# Altium schematic sheet SD Card.SchDoc: SD Card & SPI Select Switch
size 292 x 193 mm; DocumentNumber: 24; SheetNumber: 28; SheetTotal: 28
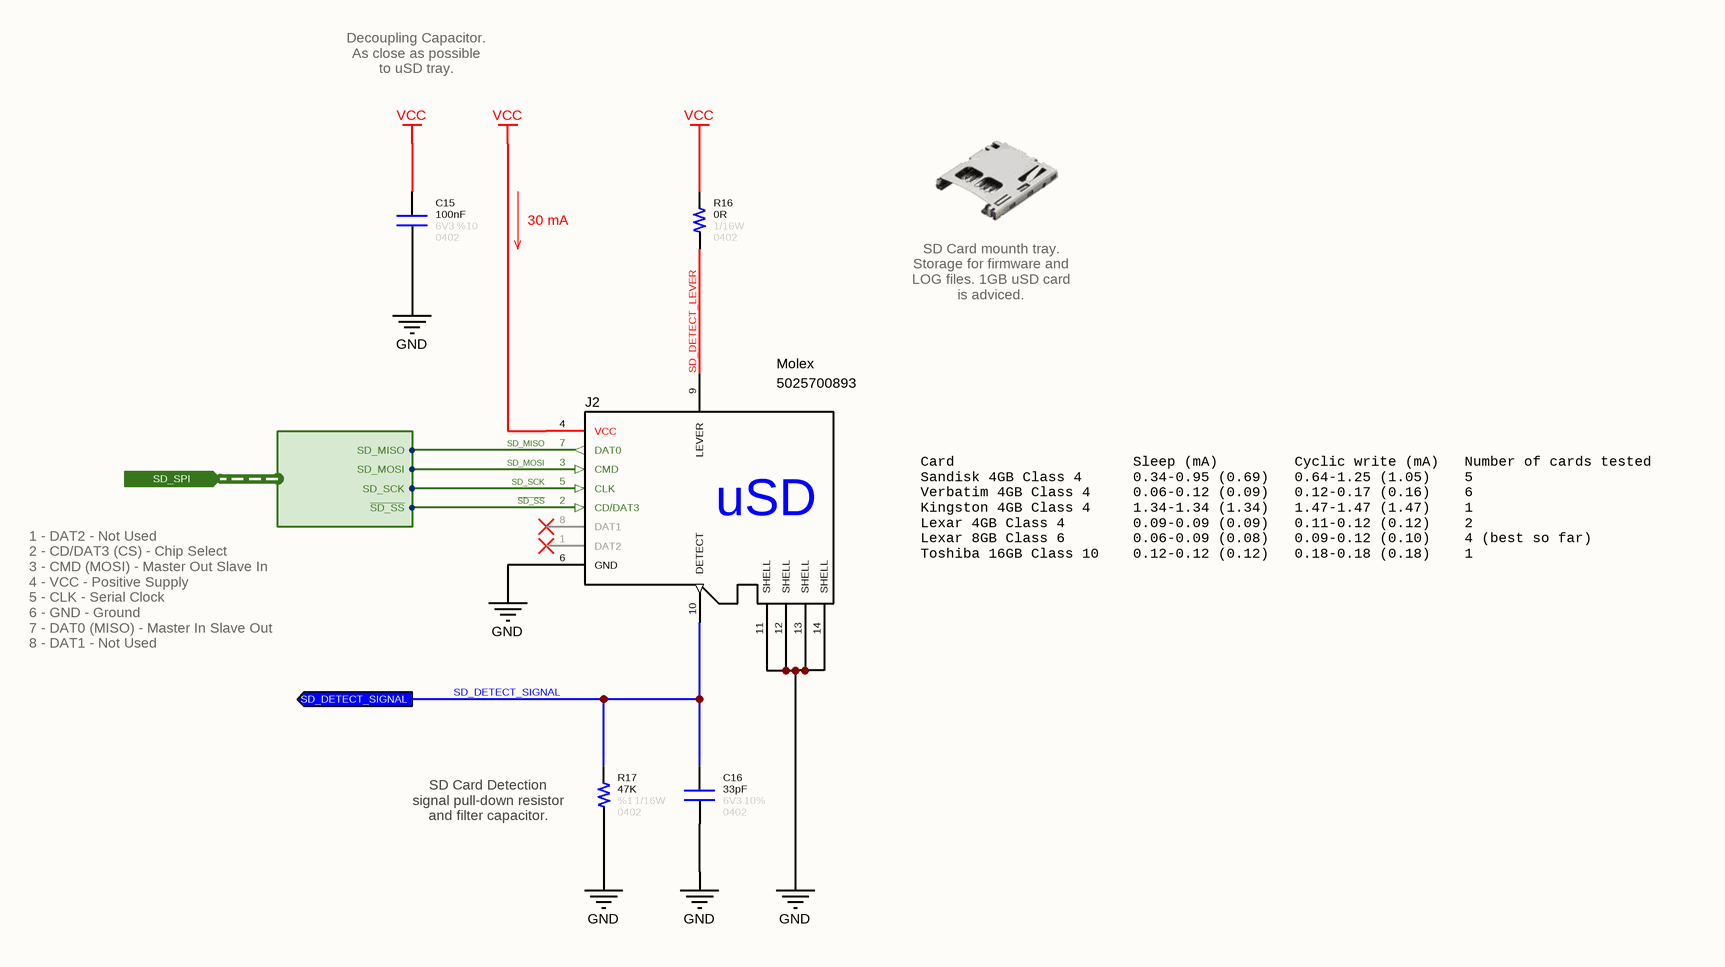
[diagram p0: SD Card.SchDoc]

## Parts
C15  value 100nF  Tolerance: %10  Voltage: 6V3  Case: 0402  [CAPACITOR_0402]  (hidden comment: Capacitor - 100nF [0402] (Ceramic))
C16  value 33pF  Tolerance: 10%  Case: 0402  Voltage: 6V3  [CAPACITOR_0402]  (hidden comment: Capacitor - 33pF [0402] (Ceramic))
J2  Manufacturer Name: Molex  [CONNECTOR - SD Card]  (hidden comment: 5025700893)
R16  value 0R  Case: 0402  Power: 1/16W  [RESISTOR_0402]  (hidden comment: 0R - 0402 - %1 - 1/16W)
R17  value 47K  Tolerance: %1  Case: 0402  Power: 1/16W  [RESISTOR_0402]  (hidden comment: 47K - 0402 - %1 - 1/16W)

## Ports
SD_DETECT_SIGNAL (out), SD_SPI (in, harness SD_SPI)

## Harnesses
SD_SPI: SD_MOSI, ~{SD_SS}, SD_SCK, SD_MISO

## Nets
GND: C15.1 C16.1 J2.6(GND) J2.11(SHELL) J2.12(SHELL) J2.13(SHELL) J2.14(SHELL) R17.1
VCC: C15.2 J2.4(VCC) R16.2
~{SD_SS}: J2.2(CD/DAT3) ; port SD_SPI.~{SD_SS}
SD_DETECT_LEVER: J2.9(LEVER) R16.1
SD_DETECT_SIGNAL: C16.2 J2.10(DETECT) R17.2 ; port SD_DETECT_SIGNAL
SD_MISO: J2.7(DAT0) ; port SD_SPI.SD_MISO
SD_MOSI: J2.3(CMD) ; port SD_SPI.SD_MOSI
SD_SCK: J2.5(CLK) ; port SD_SPI.SD_SCK

Not connected (* = marked no-connect by the designer): J2 1(DAT2)* 8(DAT1)*

## Notes on the sheet
- Decoupling Capacitor. As close as possible to uSD tray.
- 30 mA
- SD Card mounth tray. Storage for firmware and LOG files. 1GB uSD card is adviced.
- Card                     Sleep (mA)         Cyclic write (mA)   Number of cards tested
  Sandisk 4GB Class 4      0.34-0.95 (0.69)   0.64-1.25 (1.05)    5
  Verbatim 4GB Class 4     0.06-0.12 (0.09)   0.12-0.17 (0.16)    6
  Kingston 4GB Class 4     1.34-1.34 (1.34)   1.47-1.47 (1.47)    1
  Lexar 4GB Class 4        0.09-0.09 (0.09)   0.11-0.12 (0.12)    2
  Lexar 8GB Class 6        0.06-0.09 (0.08)   0.09-0.12 (0.10)    4 (best so far)
  Toshiba 16GB Class 10    0.12-0.12 (0.12)   0.18-0.18 (0.18)    1
- 1 - DAT2 - Not Used
  2 - CD/DAT3 (CS) - Chip Select
  3 - CMD (MOSI) - Master Out Slave In
  4 - VCC - Positive Supply
  5 - CLK - Serial Clock
  6 - GND - Ground
  7 - DAT0 (MISO) - Master In Slave Out
  8 - DAT1 - Not Used
- (near R17) SD Card Detection signal pull-down resistor and filter capacitor.
- © 2021 All rights reserved.
  This document may not, in whole or in part, be copied, photocopied, reproduced, translated or converted to any electronic or machine readable from without prior written permission of Mehmet Günce Akkoyun.
  Engineer contact : akkoyun@me.com
- Property of
- Engineer :
- Date :
- Size :
- A4
- Time :
- Project :
- Page :
- /
- Customer :
- Product ID :
- Module ID :
- Version :
- File :
- Revision :
- (in symbol Connector - SD Card Slot) uSD

## Library data of the parts
C15 = Capacitor - 100nF [0402-6V3]: Capacitor - 100nF [0402-6V3] (Ceramic); Manufacturer Name: AVX; Manufacturer Part Number: 04026D104KAT4A; ComponentLink1Description: Mouser; ComponentLink1URL: https://www.mouser.com.tr/ProductDetail/AVX/04026D104KAT4A?qs=sGAEpiMZZMs0AnBnWHyRQPg4iYkCw7IMED%2F4kpqgf7w%3D; ComponentLink2Description: DataSheet; ComponentLink2URL: https://www.mouser.com.tr/datasheet/2/40/cx5r-776519.pdf
C16 = Capacitor - 33pF [0402-6V3]: Manufacturer Name: Kemet; Manufacturer Part Number: C0402C330J9RACAUTO; ComponentLink1Description: DataSheet; ComponentLink1URL: https://api.kemet.com/component-edge/download/datasheet/C0402C330J9RACAUTO.pdf; ComponentLink2Description: Mouser; ComponentLink2URL: https://www.mouser.com/Search/Refine.aspx?Keyword=80-C0402C330J9RAUTO
J2 = Connector - SD Card Slot: CONN MICRO SD CARD PUSH-PUSH R/A; Product Type: Card Connectors; Case: SMD; RoHS: Yes; Card Type: microSD; Manufacturer Part Number: 5025700893
R16 = Resistor - 0R [0402]: Thick Film Resistors - SMD 1/16 W 0 Ohm; Manufacturer Name: Vishay; Manufacturer Part Number: CRCW04020000Z0ED; ComponentLink1Description: DataSheet; ComponentLink1URL: https://www.mouser.com.tr/datasheet/2/427/dcrcwe3-1762152.pdf; ComponentLink2Description: Mouser; ComponentLink2URL: https://www.mouser.com.tr/ProductDetail/Vishay-Dale/CRCW04020000Z0ED?qs=sGAEpiMZZMu61qfTUdNhG2DpbjADlD3GG34cJb50zyg%3D
R17 = Resistor - 47K [0402]: Thick Film Resistors - SMD 1/16 W 47 KOhm 1%; Manufacturer Name: Vishay; Manufacturer Part Number: CRCW040247K0FKED; ComponentLink1Description: DataSheet; ComponentLink1URL: https://www.mouser.com.tr/datasheet/2/427/dcrcwe3-1762152.pdf; ComponentLink2Description: Mouser; ComponentLink2URL: https://www.mouser.com.tr/ProductDetail/Vishay-Dale/CRCW040247K0FKED?qs=sGAEpiMZZMu61qfTUdNhG2DpbjADlD3GL%252B3h1elTxqU%3D